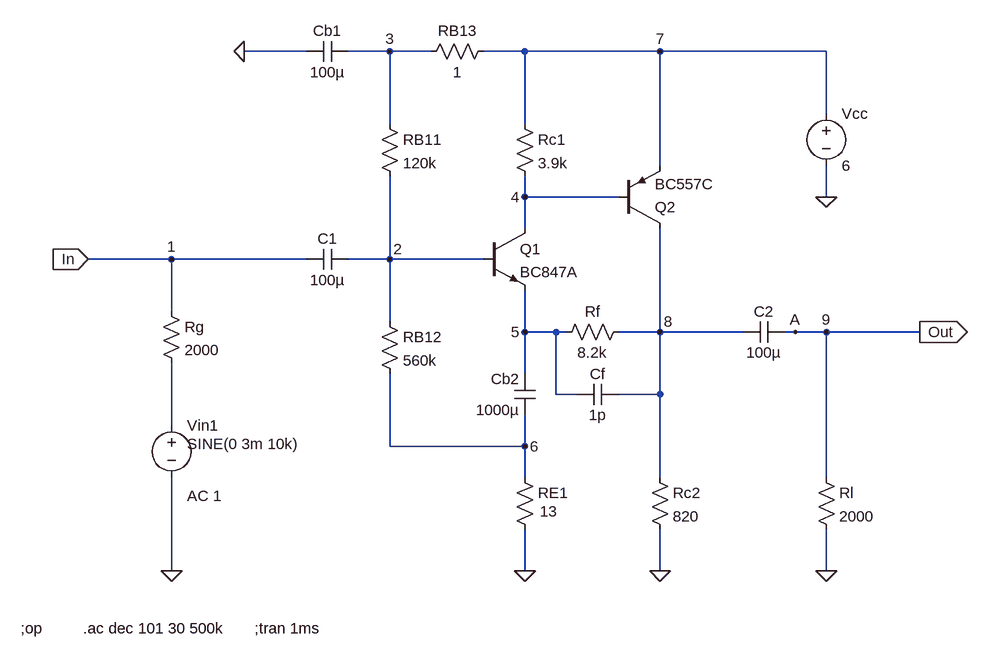
[diagram p0: schematic DC_analysis_simulation_(6V).asc]
DC_analysis_simulation_(6V).asc, the LTspice schematic file:
Version 4
SHEET 1 1192 712
WIRE -256 -368 -352 -368
WIRE -128 -368 -192 -368
WIRE -64 -368 -128 -368
WIRE 80 -368 16 -368
WIRE 288 -368 80 -368
WIRE 544 -368 288 -368
WIRE 544 -272 544 -368
WIRE -128 -256 -128 -368
WIRE 80 -256 80 -368
WIRE 288 -192 288 -368
WIRE 80 -144 80 -176
WIRE 224 -144 80 -144
WIRE 544 -144 544 -192
WIRE 80 -96 80 -144
WIRE -464 -48 -592 -48
WIRE -256 -48 -464 -48
WIRE -128 -48 -128 -176
WIRE -128 -48 -192 -48
WIRE 16 -48 -128 -48
WIRE -464 32 -464 -48
WIRE -128 48 -128 -48
WIRE 80 64 80 0
WIRE 128 64 80 64
WIRE 144 64 128 64
WIRE 288 64 288 -96
WIRE 288 64 224 64
WIRE 416 64 288 64
WIRE 496 64 480 64
WIRE 544 64 496 64
WIRE 688 64 544 64
WIRE 80 128 80 64
WIRE 128 160 128 64
WIRE 160 160 128 160
WIRE 288 160 288 64
WIRE 288 160 224 160
WIRE -464 208 -464 112
WIRE -128 240 -128 128
WIRE 80 240 80 192
WIRE 80 240 -128 240
WIRE 80 288 80 240
WIRE 288 288 288 160
WIRE 544 288 544 64
WIRE -464 432 -464 288
WIRE 80 432 80 368
WIRE 288 432 288 368
WIRE 544 432 544 368
FLAG -352 -368 0
FLAG 496 64 A
FLAG 544 -144 0
FLAG 688 64 Out
IOPIN 688 64 Out
FLAG -592 -48 In
IOPIN -592 -48 In
FLAG -464 -48 1
FLAG -128 -48 2
FLAG -128 -368 3
FLAG 80 64 5
FLAG 80 240 6
FLAG 288 64 8
FLAG 80 -144 4
FLAG 288 -368 7
FLAG 544 64 9
FLAG -464 432 0
FLAG 80 432 0
FLAG 288 432 0
FLAG 544 432 0
SYMBOL res 32 -384 R90
WINDOW 0 0 56 VBottom 2
WINDOW 3 32 56 VTop 2
SYMATTR InstName RB13
SYMATTR Value 1
SYMBOL res -144 -272 R0
SYMATTR InstName RB11
SYMATTR Value 120k
SYMBOL res -144 32 R0
SYMATTR InstName RB12
SYMATTR Value 560k
SYMBOL res 64 272 R0
WINDOW 3 39 68 Left 2
SYMATTR Value 13
SYMATTR InstName RE1
SYMBOL res 240 48 R90
WINDOW 0 0 56 VBottom 2
WINDOW 3 32 56 VTop 2
SYMATTR InstName Rf
SYMATTR Value 8.2k
SYMBOL res 272 272 R0
SYMATTR InstName Rc2
SYMATTR Value 820
SYMBOL voltage 544 -288 R0
WINDOW 123 0 0 Left 0
WINDOW 39 0 0 Left 0
SYMATTR InstName Vcc
SYMATTR Value 6
SYMBOL npn 16 -96 R0
SYMATTR InstName Q1
SYMATTR Value BC847A
SYMBOL pnp 224 -96 M180
SYMATTR InstName Q2
SYMATTR Value BC557C
SYMBOL res 64 -272 R0
SYMATTR InstName Rc1
SYMATTR Value 3.9k
SYMBOL cap 224 144 R90
WINDOW 0 0 32 VBottom 2
WINDOW 3 32 32 VTop 2
SYMATTR InstName Cf
SYMATTR Value 1p
SYMBOL cap -192 -64 R90
WINDOW 0 0 32 VBottom 2
WINDOW 3 32 32 VTop 2
SYMATTR InstName C1
SYMATTR Value 100µ
SYMBOL cap 96 192 R180
WINDOW 0 24 56 Left 2
WINDOW 3 24 8 Left 2
SYMATTR InstName Cb2
SYMATTR Value 1000µ
SYMBOL cap -256 -352 R270
WINDOW 0 32 32 VTop 2
WINDOW 3 0 32 VBottom 2
SYMATTR InstName Cb1
SYMATTR Value 100µ
SYMBOL cap 416 80 R270
WINDOW 0 32 32 VTop 2
WINDOW 3 0 32 VBottom 2
SYMATTR InstName C2
SYMATTR Value 100µ
SYMBOL res -480 16 R0
SYMATTR InstName Rg
SYMATTR Value 2000
SYMBOL res 528 272 R0
SYMATTR InstName Rl
SYMATTR Value 2000
SYMBOL voltage -464 192 R0
WINDOW 123 24 124 Left 2
WINDOW 39 0 0 Left 0
WINDOW 3 24 44 Left 2
SYMATTR Value2 AC 1
SYMATTR Value SINE(0 3m 10k)
SYMATTR InstName Vin1
TEXT -696 520 Left 2 !;op
TEXT -600 520 Left 2 !.ac dec 101 30 500k
TEXT -336 520 Left 2 !;tran 1ms

The netlist it stands for:
* DC_analysis_simulation_(6V).asc
RB13 7 3 1
RB11 3 2 120k
RB12 2 6 560k
RE1 6 0 13
Rf 8 5 8.2k
Rc2 8 0 820
Vcc 7 0 6
Q1 4 2 5 0 BC847A
Q2 8 4 7 0 BC557C
Rc1 7 4 3.9k
Cf 8 5 1p
C1 2 1 100µ
Cb2 6 5 1000µ
Cb1 0 3 100µ
C2 8 9 100µ
Rg 1 N001 2000
Rl 9 0 2000
Vin1 N001 0 SINE(0 3m 10k) AC 1
.model NPN NPN
.model PNP PNP
.lib standard.bjt
;op
.ac dec 101 30 500k
;tran 1ms
.backanno
.end